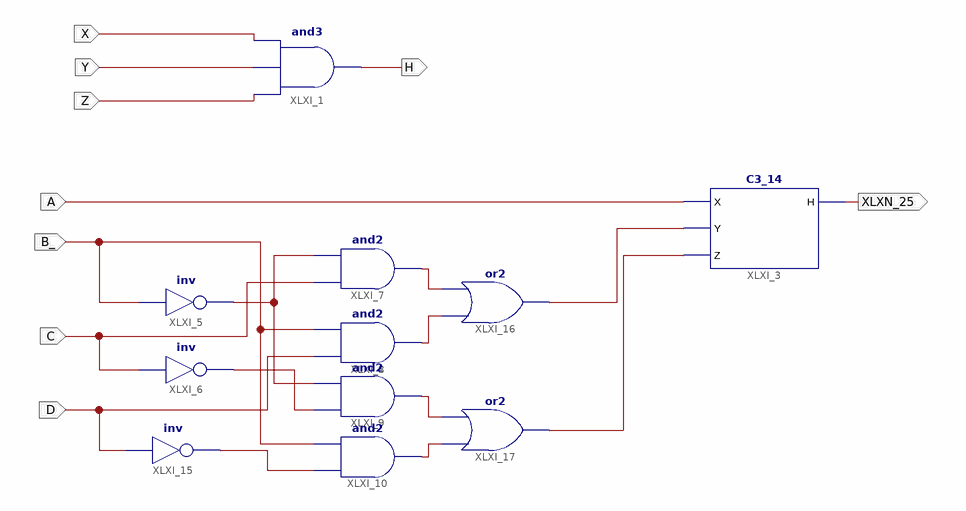
[diagram p0: schematic sheet 1]
// Xilinx ISE schematic C3_14.sch (kintex7) as structural Verilog: 11 symbols, 10 ports
module C3_14 (
  input  X,
  input  Y,
  input  Z,
  input  B,
  input  C,
  input  A,
  input  D,
  input  B_,
  output H,
  output XLXN_25
);

  wire XLXN_34, XLXN_36, XLXN_39, XLXN_40, XLXN_41, XLXN_42, XLXN_44, XLXN_45;

  and XLXI_1 (H, Z, Y, X);
  not XLXI_5 (B_, B_);
  not XLXI_6 (XLXN_34, C);
  and XLXI_7 (XLXN_39, C, B_);
  and XLXI_8 (XLXN_40, D, B_);
  and XLXI_9 (XLXN_41, XLXN_34, B_);
  and XLXI_10 (XLXN_42, XLXN_36, B_);
  not XLXI_15 (XLXN_36, D);
  or XLXI_16 (XLXN_44, XLXN_40, XLXN_39);
  or XLXI_17 (XLXN_45, XLXN_42, XLXN_41);
  C3_14 XLXI_3 (.X(A), .Y(XLXN_44), .Z(XLXN_45), .H(XLXN_25));
endmodule
